# EAGLE design VIC20_HypExp (EAGLE 9.6.2)
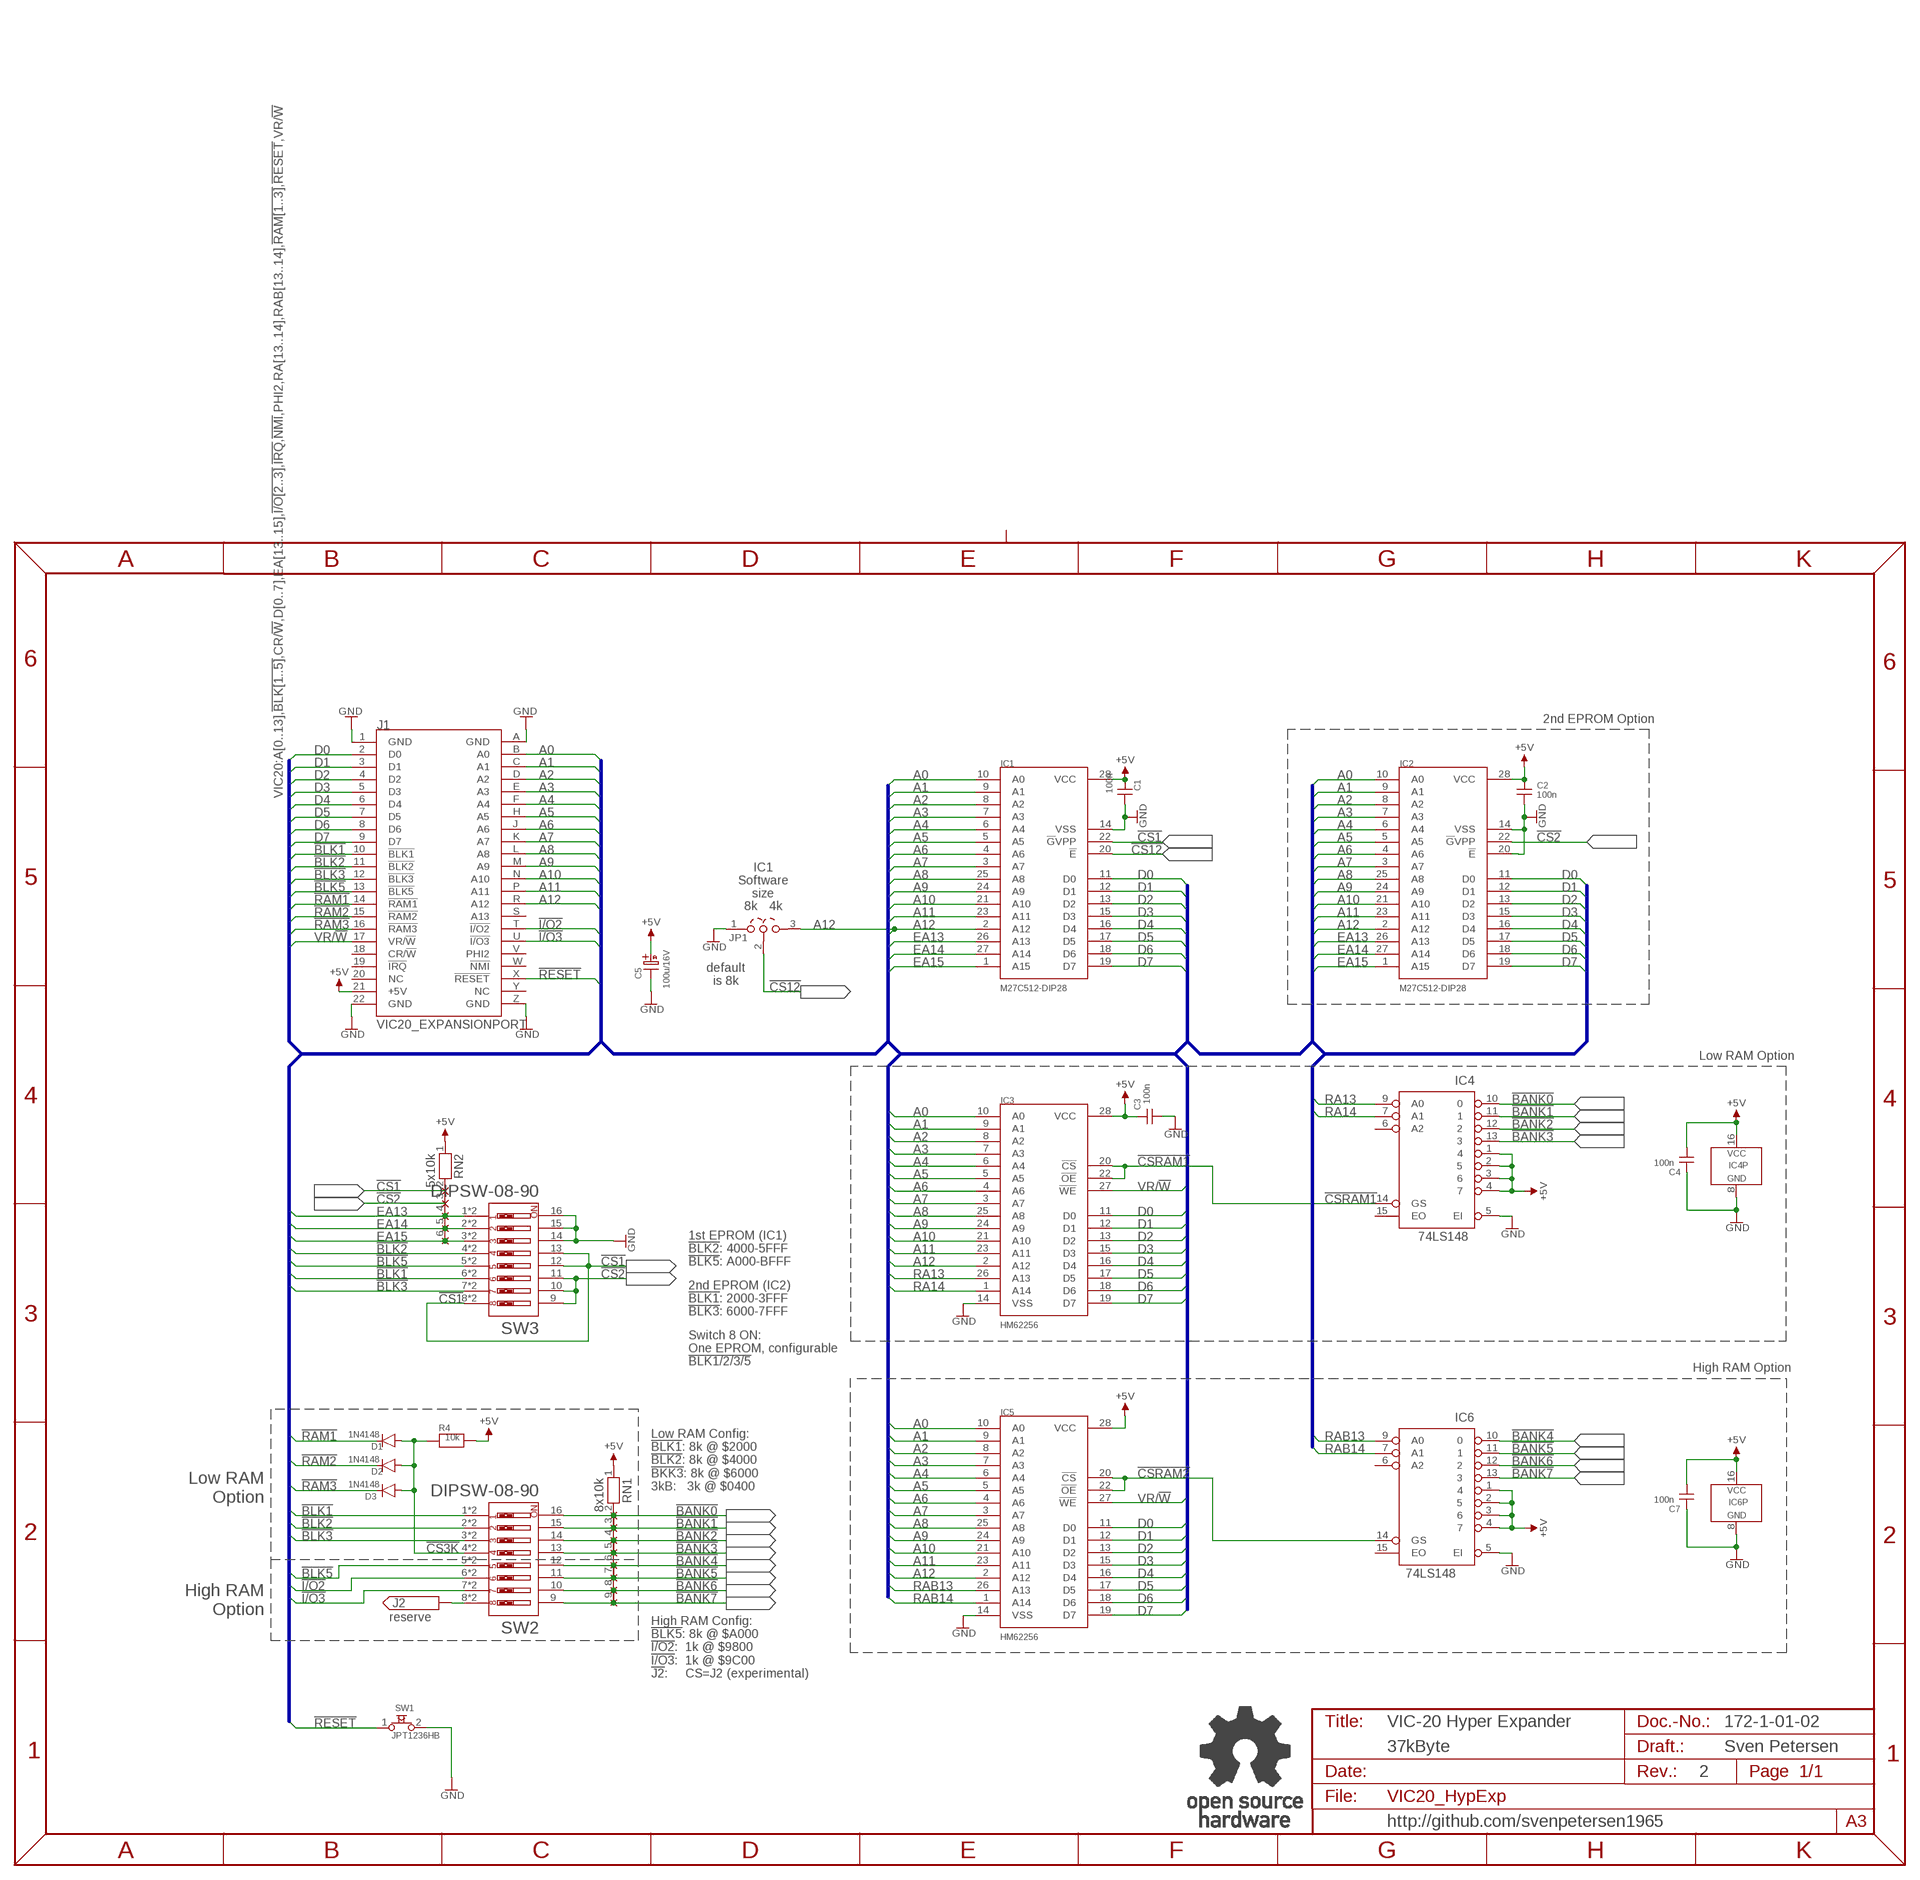
[diagram p0: schematic, sheet 1]

## Parts
C1  100n  CAP01  [C-2,5]
C2  100n  CAP01  [C-2,5]
C3  100n  CAP01  [C-2,5]
C4  100n  CAP01  [C-2,5]
C5  100u/16V  C07/2,5  [C07/2,5]
C7  100n  CAP01  [C-2,5]
D1  1N4148  1N41480.3"  [DO-35/3]
D2  1N4148  1N41480.3"  [DO-35/3]
D3  1N4148  1N41480.3"  [DO-35/3]
IC1  M27C512-DIP28  [DIL28-6]
IC2  M27C512-DIP28  [DIL28-6]
IC3  HM62256  [DIL28-6]
IC4  74LS148  74148DIL  [DIL-16]
IC5  HM62256  [DIL28-6]
IC6  74LS148  74148DIL  [DIL-16]
J1  VIC20_EXPANSIONPORT  [VIC20_EXPANSION]
J2  PINHD-1X1  [1X01]
JP1  COMBI-3P  [COMBI-3P]
R4  10k  RES04  [R-10]
RN1  8x10k  RN08  [RN-9]
RN2  5x10k  RN05  [RN-6]
SW1  JPT1236HB  [JTP_1236HB]
SW2  DIPSW-08-90  [DIPSW-08-90]
SW3  DIPSW-08-90  [DIPSW-08-90]
U$2  OPEN_SOURCE_HW  [OPENHW]

## Nets
!BANK0: IC4.10 RN1.2 SW2.16
!BANK1: IC4.11 RN1.3 SW2.15
!BANK2: IC4.12 RN1.4 SW2.14
!BANK3: IC4.13 RN1.5 SW2.13
!BANK4: IC6.10 RN1.6 SW2.12
!BANK5: IC6.11 RN1.7 SW2.11
!BANK6: IC6.12 RN1.8 SW2.10
!BANK7: IC6.13 RN1.9 SW2.9
!BLK1: J1.10(!BLK1) SW2.1 SW2.1A SW3.6 SW3.6A
!BLK2: J1.11(!BLK2) SW2.2 SW2.2A SW3.4 SW3.4A
!BLK3: J1.12(!BLK3) SW2.3 SW2.3A SW3.7 SW3.7A
!BLK5: J1.13(!BLK5) SW2.5 SW2.5A SW3.5 SW3.5A
!CS1: IC1.22(!G!VPP) RN2.2 SW3.8 SW3.8A SW3.12 SW3.13
!CS2: IC2.22(!G!VPP) RN2.3 SW3.9 SW3.10 SW3.11
!CS3K: D1.A D2.A D3.A R4.1 SW2.4 SW2.4A
!CS12: IC1.20(!E) JP1.2
!CSRAM1: IC3.20(!CS) IC3.22(!OE) IC4.14(GS)
!CSRAM2: IC5.20(!CS) IC5.22(!OE) IC6.14(GS)
!I/O2: J1.T(!I/O2) SW2.6 SW2.6A
!I/O3: J1.U(!I/O3) SW2.7 SW2.7A
!RAM1: D1.K J1.14(!RAM1)
!RAM2: D2.K J1.15(!RAM2)
!RAM3: D3.K J1.16(!RAM3)
!RESET: J1.X(!RESET) SW1.1
+5V: C1.1 C2.1 C3.2 C4.1 C5.A(+) C7.1 IC1.28(VCC) IC2.28(VCC) IC3.28(VCC) IC4.1 IC4.2 IC4.3 IC4.4 IC4.16(VCC) IC5.28(VCC) IC6.1 IC6.2 IC6.3 IC6.4 IC6.16(VCC) J1.21(+5V) R4.2 RN1.1 RN2.1
A0: IC1.10(A0) IC2.10(A0) IC3.10(A0) IC5.10(A0) J1.B(A0)
A1: IC1.9(A1) IC2.9(A1) IC3.9(A1) IC5.9(A1) J1.C(A1)
A2: IC1.8(A2) IC2.8(A2) IC3.8(A2) IC5.8(A2) J1.D(A2)
A3: IC1.7(A3) IC2.7(A3) IC3.7(A3) IC5.7(A3) J1.E(A3)
A4: IC1.6(A4) IC2.6(A4) IC3.6(A4) IC5.6(A4) J1.F(A4)
A5: IC1.5(A5) IC2.5(A5) IC3.5(A5) IC5.5(A5) J1.H(A5)
A6: IC1.4(A6) IC2.4(A6) IC3.4(A6) IC5.4(A6) J1.J(A6)
A7: IC1.3(A7) IC2.3(A7) IC3.3(A7) IC5.3(A7) J1.K(A7)
A8: IC1.25(A8) IC2.25(A8) IC3.25(A8) IC5.25(A8) J1.L(A8)
A9: IC1.24(A9) IC2.24(A9) IC3.24(A9) IC5.24(A9) J1.M(A9)
A10: IC1.21(A10) IC2.21(A10) IC3.21(A10) IC5.21(A10) J1.N(A10)
A11: IC1.23(A11) IC2.23(A11) IC3.23(A11) IC5.23(A11) J1.P(A11)
A12: IC1.2(A12) IC2.2(A12) IC3.2(A12) IC5.2(A12) J1.R(A12) JP1.3
D0: IC1.11(D0) IC2.11(D0) IC3.11(D0) IC5.11(D0) J1.2(D0)
D1: IC1.12(D1) IC2.12(D1) IC3.12(D1) IC5.12(D1) J1.3(D1)
D2: IC1.13(D2) IC2.13(D2) IC3.13(D2) IC5.13(D2) J1.4(D2)
D3: IC1.15(D3) IC2.15(D3) IC3.15(D3) IC5.15(D3) J1.5(D3)
D4: IC1.16(D4) IC2.16(D4) IC3.16(D4) IC5.16(D4) J1.6(D4)
D5: IC1.17(D5) IC2.17(D5) IC3.17(D5) IC5.17(D5) J1.7(D5)
D6: IC1.18(D6) IC2.18(D6) IC3.18(D6) IC5.18(D6) J1.8(D6)
D7: IC1.19(D7) IC2.19(D7) IC3.19(D7) IC5.19(D7) J1.9(D7)
EA13: IC1.26(A13) IC2.26(A13) RN2.4 SW3.1 SW3.1A
EA14: IC1.27(A14) IC2.27(A14) RN2.5 SW3.2 SW3.2A
EA15: IC1.1(A15) IC2.1(A15) RN2.6 SW3.3 SW3.3A
GND: C1.2 C2.2 C3.1 C4.2 C5.K(-) C7.2 IC1.14(VSS) IC2.14(VSS) IC2.20(!E) IC3.14(VSS) IC4.5(EI) IC4.8(GND) IC5.14(VSS) IC6.5(EI) IC6.8(GND) J1.1(GND) J1.22(GND) J1.A(GND) J1.Z(GND) JP1.1 SW1.2 SW3.14 SW3.15 SW3.16
N$1: J2.1 SW2.8 SW2.8A
RA13: IC3.26(A13) IC4.9(A0)
RA14: IC3.1(A14) IC4.7(A1)
RAB13: IC5.26(A13) IC6.9(A0)
RAB14: IC5.1(A14) IC6.7(A1)
VR/!W: IC3.27(!WE) IC5.27(!WE) J1.17(VR/!W)
Unconnected: IC4.6(A2) IC4.15(EO) IC6.6(A2) IC6.15(EO) J1.18(CR/!W) J1.19(!IRQ) J1.S(A13) J1.V(PHI2) J1.W(!NMI) J1.Y(NC)

## Buses
VIC20:A[0..13],!BLK[1..5],CR/!W,D[0..7],EA[13..15],!I/O[2..3],!IRQ,!NMI,PHI2,RA[13..14],RAB[13..14],!RAM[1..3],!RESET,VR/!W

## Notes on the sheet
- 2nd EPROM Option
- IC1
  Software
  size
- 8k | 4k
- default
  is 8k
- Low RAM Option
- 1st EPROM (IC1)
  !BLK2!: 4000-5FFF
  !BLK5!: A000-BFFF
- 2nd EPROM (IC2)
  !BLK1!: 2000-3FFF
  !BLK3!: 6000-7FFF
- Switch 8 ON:
  One EPROM, configurable
  !BLK1/2/3/5
- High RAM Option
- Low RAM Config:
  !BLK1!: 8k @ $2000
  !BLK2!: 8k @ $4000
  !BKK3!: 8k @ $6000
  3kB:   3k @ $0400
- Low RAM
  Option
- High RAM
  Option
- reserve
- High RAM Config:
  !BLK5!: 8k @ $A000
  !I/O2!:  1k @ $9800
  !I/O3!:  1k @ $9C00
  !J2!:     CS=J2 (experimental)
- VIC-20 Hyper Expander | 172-1-01-02
- 37kByte | Sven Petersen
- 2
- http://github.com/svenpetersen1965

## Power pins joined to a net without a drawn wire
NC: J1.20(NC)

## Library data of the parts
C1-C4 C7 = DISCRETE:CAP01
C5 = ELCO:C07/2,5
D1-D3 = Dioden:1N4148
IC1 IC2 = ST:M27C512
IC3 IC5 = Hitachi:HM62256
IC4 IC6 = 74XX:74148
J1 = Commodore:VIC20_EXPANSIONPORT
J2 = PINHEAD:PINHD-1X1
JP1 = Cutpad:COMBI-3P
R4 = DISCRETE:RES04
RN1 = DISCRETE:RN08
RN2 = DISCRETE:RN05
SW1 = Namae_Electronics:JPT1236HB
SW2 SW3 = DIPSWITCH:DIPSW-08
U$2 = Logo:OPEN_SOURCE_HW

## Board
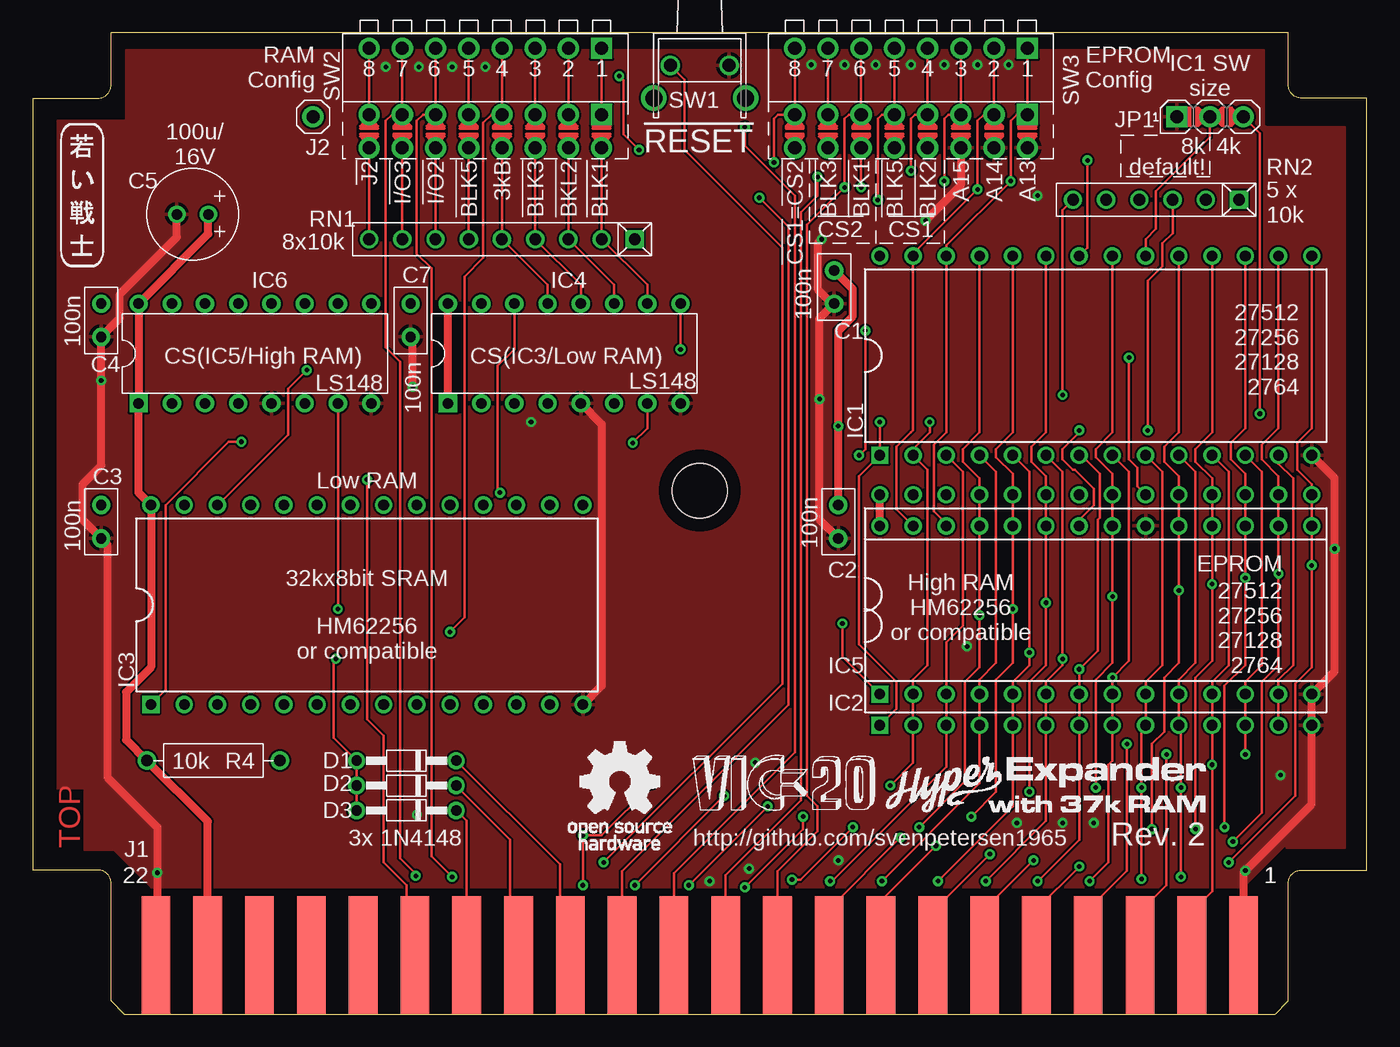
[diagram p1: board, top side]
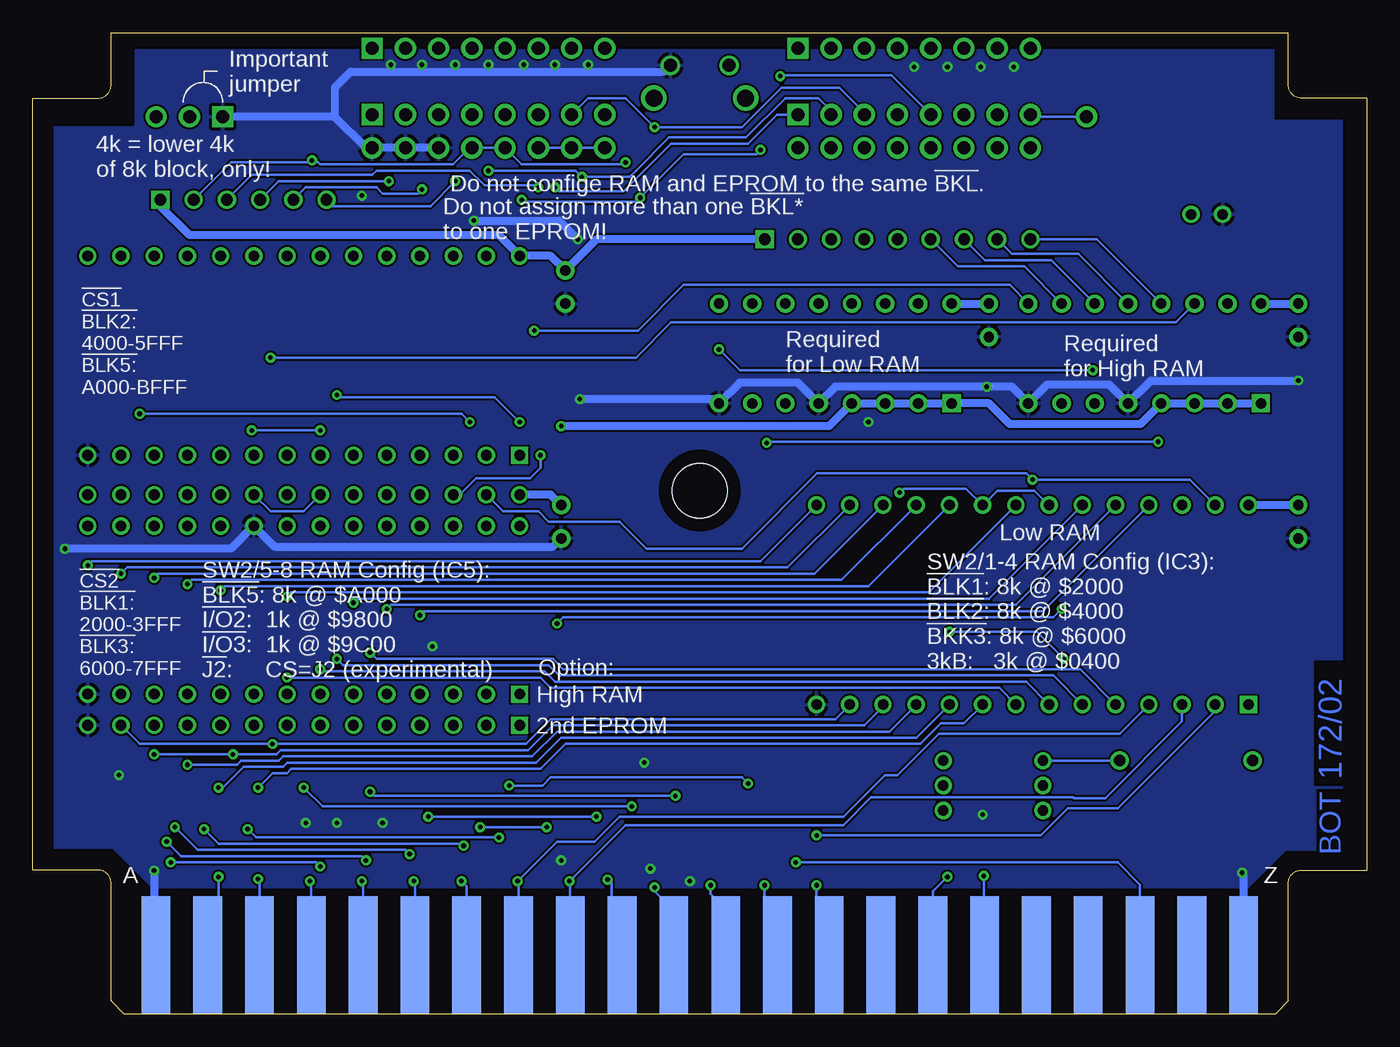
[diagram p2: board, bottom side, seen from below]

Size 102 x 75 mm. Coordinates in mm from the lower left corner, seen from the top.
Outline: 102,11 102,70 97,70 arc-90 96,71 96,75 6,75 6,71 arc-90 5,70 0,70 0,11
Copper layers (1*16): Top 0.035mm / dielectric 1.5mm / Bottom 0.035mm
Design rules "default *": minimum track width 6mil, minimum drill 0.35mm, track to track 6mil, track to pad 6mil, pad to pad 6mil, via to via 6mil, smd to smd 6mil, copper to edge 40mil, drill to drill 6mil, minimum pad ring 10mil, minimum via ring 8mil, stop-mask expansion 4mil, vias tented up to drill 23mil, thermal gap 10mil
Holes 4.2 mm at 51,40
bRestrict: 3 lines

### Footprints (pad centres in the part's own frame; a part is rotated, then mirrored left to right if it is on the bottom)
C-2,5 = drill 0.8 pad 1.397: 1 -1.27,0; 2 1.27,0
C07/2,5 = drill 0.813 pad 1.27: A -1.202,0; K 1.202,0
DO-35/3 = drill 0.8: A -3.81,0; K 3.81,0
DIL28-6 = drill 0.813 square: 1 -16.51,-7.62 | drill 0.813: 2 -13.97,-7.62; 3 -11.43,-7.62; 4 -8.89,-7.62; 5 -6.35,-7.62; 6 -3.81,-7.62; 7 -1.27,-7.62; 8 1.27,-7.62; 9 3.81,-7.62; 10 6.35,-7.62; 11 8.89,-7.62; 12 11.43,-7.62; 13 13.97,-7.62; 14 16.51,-7.62; 15 16.51,7.62; 16 13.97,7.62; 17 11.43,7.62; 18 8.89,7.62; 19 6.35,7.62; 20 3.81,7.62; 21 1.27,7.62; 22 -1.27,7.62; 23 -3.81,7.62; 24 -6.35,7.62; 25 -8.89,7.62; 26 -11.43,7.62; 27 -13.97,7.62; 28 -16.51,7.62
DIL-16 = drill 0.8 pad 1.397 square: 1 -8.89,-3.81 | drill 0.8 pad 1.397: 2 -6.35,-3.81; 3 -3.81,-3.81; 4 -1.27,-3.81; 5 1.27,-3.81; 6 3.81,-3.81; 7 6.35,-3.81; 8 8.89,-3.81; 9 8.89,3.81; 10 6.35,3.81; 11 3.81,3.81; 12 1.27,3.81; 13 -1.27,3.81; 14 -3.81,3.81; 15 -6.35,3.81; 16 -8.89,3.81
VIC20_EXPANSION = smd 2.2 x 9: 1 41.58,4.5; 2 37.62,4.5; 3 33.66,4.5; 4 29.7,4.5; 5 25.74,4.5; 6 21.78,4.5; 7 17.82,4.5; 8 13.86,4.5; 9 9.9,4.5; 10 5.94,4.5; 11 1.98,4.5; 12 -1.98,4.5; 13 -5.94,4.5; 14 -9.9,4.5; 15 -13.86,4.5; 16 -17.82,4.5; 17 -21.78,4.5; 18 -25.74,4.5; 19 -29.7,4.5; 20 -33.66,4.5; 21 -37.62,4.5; 22 -41.58,4.5 | smd 2.2 x 9 bottom: A 41.58,4.5; B 37.62,4.5; C 33.66,4.5; D 29.7,4.5; E 25.74,4.5; F 21.78,4.5; H 17.82,4.5; J 13.86,4.5; K 9.9,4.5; L 5.94,4.5; M 1.98,4.5; N -1.98,4.5; P -5.94,4.5; R -9.9,4.5; S -13.86,4.5; T -17.82,4.5; U -21.78,4.5; V -25.74,4.5; W -29.7,4.5; X -33.66,4.5; Y -37.62,4.5; Z -41.58,4.5
1X01 = drill 1 pad 1.626: 1 0,0
COMBI-3P = drill 1 pad 1.626 square: 1 -2.54,0 | drill 1 pad 1.626: 2 0,0; 3 2.54,0
R-10 = drill 0.889 pad 1.397: 1 -5.08,0; 2 5.08,0
RN-9 = drill 0.889 pad 1.397 square: 1 -10.16,0 | drill 0.889 pad 1.397: 2 -7.62,0; 3 -5.08,0; 4 -2.54,0; 5 0,0; 6 2.54,0; 7 5.08,0; 8 7.62,0; 9 10.16,0
RN-6 = drill 0.889 pad 1.397 square: 1 -6.35,0 | drill 0.889 pad 1.397: 2 -3.81,0; 3 -1.27,0; 4 1.27,0; 5 3.81,0; 6 6.35,0
JTP_1236HB = drill 1: 1 2.25,0; 2 -2.25,0 | drill 1.3: CS1 3.5,2.5; CS2 -3.5,2.5
DIPSW-08-90 = drill 1 pad 1.626 square: 1 -8.89,-1.27; 1A -8.89,-6.35 | drill 1 pad 1.626: 2 -6.35,-1.27; 2A -6.35,-6.35; 3 -3.81,-1.27; 3A -3.81,-6.35; 4 -1.27,-1.27; 4A -1.27,-6.35; 5 1.27,-1.27; 5A 1.27,-6.35; 6 3.81,-1.27; 6A 3.81,-6.35; 7 6.35,-1.27; 7A 6.35,-6.35; 8 8.89,-1.27; 8A 8.89,-6.35; 9 8.89,1.27; 10 6.35,1.27; 11 3.81,1.27; 12 1.27,1.27; 13 -1.27,1.27; 14 -3.81,1.27; 15 -6.35,1.27; 16 -8.89,1.27

### Placement (x,y rotation side)
C1  61.28,55.56 270 top
C2  61.59,37.62 270 top
C3  5.24,37.62 90 top
C4  5.24,53.02 270 top
C5  12.22,61.12 180 top
C7  28.89,53.02 270 top
D1  28.57,19.37 0 top
D2  28.57,17.46 0 top
D3  28.57,15.56 0 top
IC1  81.28,50.32 0 top
IC2  81.28,29.69 0 top
IC3  25.56,31.27 0 top
IC4  40.64,50.48 0 top
IC5  81.28,32.07 0 top
IC6  16.99,50.48 0 top
J1  51,0 0 top
J2  21.43,68.58 0 top
JP1  90.01,68.58 0 top
R4  13.81,19.37 180 top
RN1  35.88,59.21 180 top
RN2  85.88,62.23 180 top
SW1  51,72.5 180 top
SW2  34.61,67.47 180 top
SW3  67.15,67.47 180 top
U$2  40.96,12.54 0 top
U$15  [SVEN_TAG]  3.81,62.71 0 top
U$16  [2LAYER]  3.65,12.7 90 top
U$40  [PCB-TITLE/]  0,87 0 top  (outside the outline)
U$42  [VIC-20]  50.48,15.56 0 top
U$58  [HYPER_EXPANDER]  65.25,15.4 0 top

### Tracks (layer width: path | path; a pad name or v marks a point on that pad's centre or on a via)
!BANK0
  Top 0.203: SW2.16 RN1.2 46.99,55.72 IC4.10
!BANK1
  Top 0.203: SW2.15 RN1.3 44.45,55.72 IC4.11
!BANK2
  Top 0.203: SW2.14 RN1.4 41.91,55.72 IC4.12
!BANK3
  Top 0.203: SW2.13 RN1.5 39.37,55.72 IC4.13
!BANK4
  Top 0.203: SW2.12 RN1.6
  Bottom 0.203: IC6.10 26.19,57.15 31.27,57.15 RN1.6
!BANK5
  Top 0.203: SW2.11 RN1.7
  Bottom 0.203: IC6.11 24.13,57.63 29.21,57.63 RN1.7
!BANK6
  Top 0.203: SW2.10 RN1.8
  Bottom 0.203: IC6.12 22.07,58.1 27.15,58.1 RN1.8
!BANK7
  Top 0.203: SW2.9 RN1.9
  Bottom 0.203: IC6.13 20.64,59.21 RN1.9
!BLK1  (via drill 0.35)
  Top 0.203: 62.07,63.5 62.07,68.42 62.39,68.74 SW3.6 SW3.6A | 62.07,63.5 v62.07,63.19 | J1.10 56.94,10.9 59.21,13.18 60.01,13.97 60.01,15.88 59.21,16.67 59.21,16.83 59.21,60.33 v62.07,63.18 62.07,63.5 | SW2.1 43.5,72.65 SW2.1A
  Bottom 0.203: SW2.1 45.09,68.74 47.31,66.52 53.18,66.52 56.83,62.87 61.75,62.87 v62.07,63.19
!BLK2  (via drill 0.35)
  Top 0.203: v67.15,64.45 67.15,68.42 67.47,68.74 SW3.4 SW3.4A | J1.11 52.98,10.59 58.74,16.35 58.74,61.28 60.01,62.55 v60.01,63.98 | SW2.2 SW2.2A
  Bottom 0.203: SW2.2 40.96,69.06 41.91,70.01 44.45,70.01 47.47,66.99 53.34,66.99 55.88,64.45 56.36,63.98 v60.01,63.98 60.48,64.45 v67.15,64.45
!BLK3  (via drill 0.35)
  Top 0.203: J1.12 49.02,10.76 58.26,20 58.26,62.55 54.45,66.36 v54.45,67.79 | SW2.3 SW2.3A | SW3.7 SW3.7A
  Bottom 0.203: SW3.7 59.53,70.01 56.67,70.01 v54.45,67.79 47.78,67.79 44.77,70.8 40.32,70.8 38.42,68.9 SW2.3
!BLK5  (via drill 0.35)
  Top 0.203: v64.61,62.23 64.61,68.42 64.93,68.74 SW3.5 SW3.5A | v44.85,71.68 45.16,71.36 45.16,67.23 v46.35,66.04 | J1.13 45.06,10.93 57.78,23.65 57.78,60.17 v55.56,62.39 | SW2.5 SW2.5A
  Bottom 0.203: SW2.5 36.35,71.75 44.77,71.75 v44.85,71.68 | v46.35,66.04 46.67,65.72 52.23,65.72 v55.56,62.39 55.88,62.07 64.45,62.07 v64.61,62.23
!CS1  (via drill 0.35)
  Top 0.203: v56.67,65.09 56.67,68.42 56.99,68.74 SW3.8 SW3.8A | IC1.22 80.64,58.58 v80.64,65.25
  Bottom 0.203: v56.67,65.09 56.83,64.93 64.61,64.93 SW3.12 SW3.13 68.58,66.2 69.85,64.93 80.01,64.93 80.17,65.09 80.49,65.09 v80.64,65.25 80.8,65.09 86.84,65.09 RN2.2
!CS2  (via drill 0.35)
  Top 0.203: IC2.22 80.01,37.78 81.12,38.89 81.12,40.16 79.69,41.59 79.53,41.59 78.74,42.39 78.74,43.18 80.01,44.45 v80.01,44.61 | v85.25,44.61 85.25,56.04 86.36,57.15 86.36,58.9 87.15,59.69 RN2.3 | SW3.11 v63.34,63.18
  Bottom 0.203: v80.01,44.61 v85.25,44.61 | SW3.9 SW3.10 SW3.11 | v63.34,63.18 63.5,63.34 66.83,63.34 67.47,63.34 68.58,64.45 75.72,64.45 76.04,64.14 85.25,64.14 RN2.3
!CS3K  (via drill 0.35)
  Top 0.203: D3.A D2.A D1.A 23.02,21.11 23.02,27.15 v23.18,27.15 | v31.91,29.21 33.02,30.32 33.02,56.36 34.45,57.78 34.45,68.1 35.08,68.74 SW2.4 SW2.4A
  Bottom 0.203: D1.A R4.1 | v31.91,29.21 25.24,29.21 v23.18,27.15
!CS12
  Top 0.203: IC1.20 85.09,59.21 85.88,60.01 85.88,62.87 90.01,66.99 JP1.2
!CSRAM1  (via drill 0.35)
  Top 0.203: IC4.14 36.83,50.8 35.56,49.53 35.56,40.01 v35.72,39.85
  Bottom 0.203: IC3.22 25.4,40.01 28.26,40.01 IC3.20 30.64,40.16 35.4,40.16 v35.72,39.85
!CSRAM2  (via drill 0.35)
  Top 0.203: IC5.20 84.45,40.32 84.45,41.75 83.82,42.39 v83.82,50.16
  Bottom 0.203: IC5.20 83.82,38.42 81.28,38.42 IC5.22 | IC6.14 14.61,52.86 53.18,52.86 55.88,50.16 v83.82,50.16
!I/O2  (via drill 0.35)
  Top 0.203: v32.07,10.48 30.48,12.06 30.48,56.99 29.37,58.1 29.37,68.26 29.84,68.74 SW2.6 SW2.6A
  Bottom 0.203: v32.07,10.48 33.18,9.37 J1.T
!I/O3  (via drill 0.35)
  Top 0.203: v29.29,10.56 29.37,10.64 28.1,11.91 28.1,49.85 26.99,50.96 26.99,68.26 27.46,68.74 SW2.7 SW2.7A
  Bottom 0.203: v29.29,10.56 29.29,4.57 J1.U
!RAM1
  Top 0.203: J1.14 40.31,5.29 40.31,9.51 40.32,9.53 40.32,11.43 D1.K
!RAM2
  Top 0.203: J1.15 36.51,5.13 36.51,13.34 D2.K
!RAM3
  Top 0.203: D3.K 33.18,14.76 J1.16
!RESET  (via drill 0.35)
  Top 0.203: v43.66,11.59 57.31,25.24 57.31,58.58 49.85,66.04 49.85,71.4 SW1.1
  Bottom 0.203: J1.X 17.34,9.88 19.05,11.59 v43.66,11.59
+5V  (via drill 0.35)
  Top 0.61: IC4.1 IC4.16 | IC2.28 IC5.28 | C2.1 v61.59,44.93 61.59,52.23 62.71,53.34 62.71,55.4 C1.1 | C5.A 13.43,59.62 IC6.16 IC6.1 8.1,39.85 IC3.28 9.05,26.51 7.14,24.61 7.14,20.95 R4.2 13.38,14.72 J1.21
  Bottom 0.61: IC4.16 C7.1 | RN1.1 58.9,59.21 C1.1 62.39,57.94 IC1.28 66.36,59.53 90.01,59.53 92.23,61.75 RN2.1 | IC6.1 IC6.2 IC6.3 IC6.4 17.3,45.09 27.3,45.09 28.89,46.67 IC4.1 IC4.2 IC4.3 IC4.4 41.12,44.93 v61.59,44.93 | IC6.16 C4.1 | C2.1 62.39,39.69 IC5.28 | C3.2 IC3.28
A0  (via drill 0.35)
  Top 0.203: v87.79,10.48 v87.79,17.3 87.79,21.91 IC2.10 IC5.10 87.63,25.56 88.9,26.83 88.9,41.43 IC1.10
  Bottom 0.203: J1.B 87.79,5.33 v87.79,10.48 | v87.79,17.3 87.47,17.3 85.88,18.89 82.87,18.89 82.55,19.21 63.5,19.21 61.59,21.11 34.45,21.11 IC3.10
A1  (via drill 0.35)
  Top 0.203: v84.77,10.32 v84.77,17.3 84.77,21.75 IC2.9 IC5.9 85.09,25.4 86.36,26.67 86.36,41.43 IC1.9
  Bottom 0.203: J1.C 84.66,10.21 v84.77,10.32 | v84.77,17.3 83.66,18.41 82.55,18.41 82.23,18.73 63.18,18.73 61.28,20.64 34.13,20.64 32.54,22.23 30.8,22.23 IC3.9
A2  (via drill 0.35)
  Top 0.203: v80.8,10.16 82.23,11.59 82.23,19.05 82.55,19.37 IC2.8 IC5.8 v82.55,25.72 83.82,26.99 83.82,41.43 IC1.8
  Bottom 0.203: J1.D 80.7,10.06 v80.8,10.16 | IC3.8 28.1,24.92 62.39,24.92 63.18,25.72 v82.55,25.72
A3  (via drill 0.35)
  Top 0.203: v76.83,10.16 80.01,13.34 IC2.7 IC5.7 80.01,25.88 v80.01,26.35 81.44,27.78 81.44,37.78 81.6,37.94 81.6,41.27 80.17,42.7 IC1.7
  Bottom 0.203: J1.E 76.74,10.06 v76.83,10.16 | IC3.7 26.04,25.4 62.07,25.4 62.87,26.19 79.85,26.19 v80.01,26.35
A4  (via drill 0.35)
  Top 0.203: v72.87,10.16 77.47,14.76 IC2.6 IC5.6 77.47,25.4 78.74,26.67 v78.74,27.15 78.74,41.43 IC1.6
  Bottom 0.203: J1.F 72.78,10.07 v72.87,10.16 | IC3.6 23.97,25.88 61.75,25.88 62.55,26.67 78.26,26.67 v78.74,27.15
A5  (via drill 0.35)
  Top 0.203: v69.22,10.16 74.93,15.88 IC2.5 IC5.5 74.93,25.4 76.2,26.67 v76.2,27.62 76.2,41.43 IC1.5
  Bottom 0.203: J1.H 68.82,9.77 v69.22,10.16 | IC3.5 21.91,26.35 61.44,26.35 62.23,27.15 75.72,27.15 v76.2,27.62
A6  (via drill 0.35)
  Top 0.203: v64.93,10.16 72.39,17.62 IC2.4 IC5.4 72.39,25.56 73.66,26.83 73.66,41.43 IC1.4
  Bottom 0.203: J1.J 64.86,10.09 v64.93,10.16 61.91,13.18 59.05,13.18 57.15,15.08 40.01,15.08 36.83,18.26 35.88,18.26 32.7,21.43 18.89,21.43 IC3.4
A7  (via drill 0.35)
  Top 0.203: IC1.3 71.12,41.43 71.12,29.69 69.85,28.42 IC5.3 IC2.3 69.85,18.89 61.04,10.08 v60.96,10.16
  Bottom 0.203: J1.K 60.9,10.1 v60.96,10.16 56.67,14.45 40.01,14.45 37.9,16.55 22.43,16.55 22.38,16.51 20,16.51 14.13,22.38 IC3.3
A8  (via drill 0.35)
  Top 0.203: v67.79,14.29 71.28,17.78 71.28,25.4 72.39,26.51 v72.39,30.48 IC2.25 IC5.25 72.39,40.96 71.12,42.23 71.12,43.18 72.39,44.45 IC1.25 | v62.71,14.29 58.69,10.27 v58.05,10.27
  Bottom 0.203: v58.05,10.27 57.73,10.27 57.73,5.29 J1.L | v67.79,14.29 v62.71,14.29 | IC3.25 24.77,30.8 72.07,30.8 v72.39,30.48
A9  (via drill 0.35)
  Top 0.203: IC1.24 74.93,44.45 73.66,43.18 73.66,42.55 74.93,41.27 IC5.24 IC2.24 v74.93,30.96 74.93,26.83 73.66,25.56 73.66,16.99 v71.75,15.08 | v54.45,9.68 58.9,14.13 v58.9,15.08
  Bottom 0.203: J1.M 53.46,4.98 53.46,8.37 54.45,9.37 v54.45,9.68 | v71.75,15.08 v58.9,15.08 | IC3.24 26.83,31.27 74.61,31.27 v74.93,30.96
A10  (via drill 0.35)
  Top 0.203: IC1.21 82.55,44.45 81.28,43.18 81.28,42.55 82.55,41.27 IC5.21 IC2.21 v82.55,31.91 82.55,26.83 81.28,25.56 v81.28,17.3 | v50.16,9.84 v56.2,15.88
  Bottom 0.203: J1.N 49.02,8.06 50.16,9.21 v50.16,9.84 | v56.2,15.88 79.85,15.88 v81.28,17.3 | IC3.21 33.5,32.23 82.23,32.23 v82.55,31.91
A11  (via drill 0.35)
  Top 0.203: IC1.23 77.47,44.45 76.36,43.34 76.36,42.23 77.47,41.12 IC5.23 IC2.23 v77.47,31.43 77.47,26.67 76.2,25.4 v76.2,16.99 | v46.04,9.84 v52.86,16.67
  Bottom 0.203: J1.P 46.04,5.48 v46.04,9.84 | v52.86,16.67 75.88,16.67 v76.2,16.99 | IC3.23 28.89,31.75 77.15,31.75 v77.47,31.43
A12  (via drill 0.35)
  Top 0.203: v68.58,45.24 68.58,44.45 67.31,43.18 IC1.2 68.42,41.59 68.42,26.67 67.31,25.56 IC5.2 IC2.2 67.31,19.21 v65.56,17.46 | v93.82,45.88 93.82,67.31 JP1.3 | v47.31,17.62 47.31,17.46 43.5,13.65 v42.07,13.65 v42.07,9.84
  Bottom 0.203: v68.58,45.24 69.22,45.88 v93.82,45.88 | J1.R 42.07,5.47 v42.07,9.84 | v65.56,17.46 63.02,17.46 62.39,18.1 47.78,18.1 v47.31,17.62 | v42.07,13.65 24.92,13.65 22.86,15.72 19.05,15.72 11.59,23.18 IC3.2
D0  (via drill 0.35)
  Top 0.203: J1.2 88.62,7.82 90.17,9.37 v90.17,19.05 IC2.11 IC5.11 90.17,25.4 91.44,26.67 91.44,41.43 IC1.11
  Bottom 0.203: v90.17,19.05 86.36,19.05 86.04,19.37 83.19,19.37 82.87,19.68 63.82,19.68 61.91,21.59 36.51,21.59 IC3.11
D1  (via drill 0.35)
  Top 0.203: J1.3 84.66,7.83 86.68,9.84 v86.68,19.84 | v92.71,19.84 IC2.12 IC5.12 92.71,25.4 93.98,26.67 93.98,41.43 IC1.12
  Bottom 0.203: v92.71,19.84 v86.68,19.84 83.34,19.84 83.03,20.16 69.22,20.16 64.14,20.16 62.23,22.07 38.42,22.07 36.99,23.5 IC3.12
D2  (via drill 0.35)
  Top 0.203: J1.4 80.7,7.99 83.66,10.95 v83.66,20.64 | IC2.13 IC5.13 95.25,25.56 96.36,26.67 96.36,40.96 95.25,42.07 IC1.13
  Bottom 0.203: IC3.13 40.64,22.54 62.39,22.54 64.29,20.64 v83.66,20.64 93.82,20.64 IC2.13
D3  (via drill 0.35)
  Top 0.203: J1.5 76.74,8 v80.01,11.27 | v91.44,11.59 96.52,16.67 96.52,25.24 97.79,26.51 v97.79,34.29 IC2.15 IC5.15 97.79,40.48 96.68,41.59 96.68,43.66 97.79,44.77 IC1.15
  Bottom 0.203: v80.01,11.27 80.33,11.59 v91.44,11.59 | IC3.15 46.35,34.61 97.47,34.61 v97.79,34.29
D4  (via drill 0.35)
  Top 0.203: J1.6 72.78,8.01 v76.52,11.75 | v91.76,13.18 93.98,15.4 93.98,25.4 95.25,26.67 v95.25,33.66 IC2.16 IC5.16 95.25,41.12 93.98,42.39 93.98,43.5 95.25,44.77 IC1.16
  Bottom 0.203: v76.52,11.75 76.83,12.06 90.65,12.06 v91.76,13.18 | IC3.16 44.29,34.13 94.77,34.13 v95.25,33.66
D5  (via drill 0.35)
  Top 0.203: J1.7 68.82,7.86 v73.18,12.22 | v91.12,14.29 91.12,25.08 92.71,26.67 v92.71,33.34 IC2.17 IC5.17 92.71,41.27 91.6,42.39 91.6,43.66 92.71,44.77 IC1.17
  Bottom 0.203: v73.18,12.22 73.5,12.54 89.38,12.54 v91.12,14.29 | IC3.17 42.23,33.66 92.39,33.66 v92.71,33.34
D6  (via drill 0.35)
  Top 0.203: J1.8 64.86,8.66 v69.06,12.86 | v88.9,14.13 88.9,25.72 90.17,26.99 v90.17,32.86 IC2.18 IC5.18 90.17,40.96 88.9,42.23 88.9,43.18 90.17,44.45 IC1.18
  Bottom 0.203: v69.06,12.86 69.22,13.02 87.79,13.02 v88.9,14.13 | IC3.18 40.16,33.18 89.85,33.18 v90.17,32.86
D7  (via drill 0.35)
  Top 0.203: J1.9 60.9,8.04 v66.36,13.49 | v85.57,14.13 85.57,20.64 86.52,21.59 86.52,25.72 87.63,26.83 v87.63,32.38 IC2.19 IC5.19 87.63,41.12 86.52,42.23 86.52,43.34 87.63,44.45 IC1.19
  Bottom 0.203: v85.57,14.13 84.93,13.49 v66.36,13.49 | IC3.19 38.1,32.7 87.31,32.7 v87.63,32.38
EA13  (via drill 0.35)
  Top 0.203: IC2.26 69.85,37.47 68.9,38.42 68.9,43.5 69.85,44.45 IC1.26 69.85,58.74 v74.77,63.66 74.77,68.26 75.25,68.74 SW3.1 SW3.1A
  Bottom 0.203: RN2.4 83.19,63.66 v74.77,63.66
EA14  (via drill 0.35)
  Top 0.203: IC2.27 66.04,38.58 66.04,43.34 67.15,44.45 67.31,44.61 IC1.27 67.31,58.1 v72.23,63.02 72.23,68.26 72.71,68.74 SW3.2 SW3.2A
  Bottom 0.203: RN2.5 81.12,63.18 75.72,63.18 75.25,62.71 72.55,62.71 v72.23,63.02
EA15  (via drill 0.35)
  Top 0.203: IC2.1 66.04,23.34 66.04,25.4 63.18,28.26 63.18,41.12 IC1.1 v64.77,45.24 | v78.74,47.31 78.74,61.44 RN2.6 | v69.69,63.66 69.69,68.42 70.01,68.74 SW3.3 SW3.3A
  Bottom 0.203: v64.77,45.24 66.67,47.15 78.58,47.15 v78.74,47.31 | RN2.6 79.06,61.75 71.6,61.75 v69.69,63.66
GND  (via drill 0.35)
  Top 0.61: J1.A 92.58,10.82 v92.71,10.95 97.79,16.03 IC2.14 IC5.14 99.54,26.19 v99.54,35.56 99.54,40.96 IC1.14 | IC4.5 43.5,45.09 43.5,25.08 IC3.14 | C5.K 11.02,59.37 6.67,55.02 6.67,53.18 C4.2 v5.24,48.42 5.24,41.91 3.81,40.48 3.81,37.78 C3.1 5.71,35.88 5.71,18.1 9.53,14.29 v9.53,10.79 9.53,4.61 J1.Z | v29.05,47.94 29.05,51.59 C7.2 | SW3.14 70.96,63.34 v68.26,60.64 | C2.2 60.17,37.78 v60.17,46.99 60.17,53.18 C1.2 61.12,54.29 60.01,55.4 60.01,58.9 v60.33,59.21
  Bottom 0.61: v92.71,10.95 92.71,4.63 J1.A | v99.54,35.56 86.84,35.56 IC2.20 83.5,35.72 62.23,35.72 C2.2 | SW3.14 SW3.15 SW3.16 76.52,66.2 78.9,68.58 | 78.9,68.58 JP1.1 | SW1.2 53.73,72.02 77.68,72.02 78.9,70.8 78.9,68.58 | v5.24,48.42 16.51,48.42 IC6.5 19.68,48.1 24.45,48.1 IC6.8 27.15,47.94 v29.05,47.94 40.64,47.94 IC4.5 43.5,48.26 47.94,48.26 IC4.8 49.85,46.99 v60.17,46.99 | J1.Z 9.42,10.69 v9.53,10.79 | v68.26,60.64 61.75,60.64 v60.33,59.21
  other vias: 29.37,15.24 61.59,11.75 55.24,19.21 51.75,10.16 78.74,14.61 75.25,14.61 81.12,14.61 71.44,28.1 95.41,18.26 38.1,45.24 76.83,62.55 54.77,11.11 26.99,72.39 29.53,72.39 32.07,72.39 34.61,72.39 59.53,72.55 62.07,72.55 64.45,72.55 67.15,72.55 69.69,72.55 72.23,72.55 74.61,72.55
  pour Top: 1.91,68.26 7.14,68.26 7.14,73.66 94.14,73.66 94.14,67.94 94.3,67.79 100.33,67.79 100.33,12.7 95.89,12.7 95.73,12.86 92.55,9.68 9.05,9.68 6.19,12.54 1.91,12.54
  pour Bottom: 1.91,68.26 7.14,68.26 7.14,73.66 94.14,73.66 94.14,67.94 94.3,67.79 100.33,67.79 100.33,12.7 95.89,12.7 92.87,9.68 91.6,9.68 9.05,9.68 6.19,12.54 1.91,12.54
N$1
  Top 0.203: SW2.8 SW2.8A
  Bottom 0.203: SW2.8 25.56,68.58 J2.1
RA13  (via drill 0.35)
  Top 0.203: IC3.26 19.53,44.29 19.53,47.78 v20.95,49.21 | v49.53,50.8 IC4.9
  Bottom 0.203: v20.95,49.21 47.94,49.21 v49.53,50.8
RA14  (via drill 0.35)
  Top 0.203: IC3.1 10.16,24.77 10.16,38.89 15,43.74 v15.95,43.74 | v45.88,43.66 46.99,44.77 IC4.7
  Bottom 0.203: v15.95,43.74 45.8,43.74 v45.88,43.66
RAB13  (via drill 0.35)
  Top 0.203: v63.18,42.7 63.66,43.18 v63.66,52.23
  Bottom 0.203: IC6.9 27.3,55.72 52.23,55.72 55.72,52.23 v63.66,52.23 | IC5.26 69.37,39.69 68.1,40.96 63.98,40.96 63.18,41.75 v63.18,42.7
RAB14  (via drill 0.35)
  Top 0.203: IC5.1 61.91,27.3 v61.91,29.84 | v23.34,30.96 IC6.7
  Bottom 0.203: v61.91,29.84 61.44,30.32 23.97,30.32 v23.34,30.96
VR/!W  (via drill 0.35)
  Top 0.203: J1.17 28.57,5.14 28.57,9.84 26.83,11.59 26.83,21.27 25.56,22.54 v25.56,40.84
  Bottom 0.203: IC5.27 66.04,38.42 63.34,38.42 62.55,37.62 57.15,37.62 55.09,35.56 47.78,35.56 42.03,41.31 26.04,41.31 v25.56,40.84 13.53,40.84 IC3.27

### Text on the board
Bottom: 172/02
tPlace: RAM / Config | EPROM / Config | IC1 SW / size | !RESET | 8k | 4k | 100u/ / 16V | !J2 | !I/O3 | !I/O2 | !BLK5 | 3kB | !BLK3 | !BKL2 | !BLK1 | !CS1!=!CS2 | !BLK3 | !BLK1 | !BLK5 | !BLK2 | A15 | A14 | A13 | default! | !CS2 | !CS1 | 5 x / 10k | 8x10k | 100n | 100n | 27512 / 27256 / 27128 / 2764 | CS(IC5/High RAM) | CS(IC3/Low RAM) | LS148 | LS148 | 100n | Low RAM | 100n | 100n | EPROM | 32kx8bit SRAM | High RAM | 27512 / 27256 / 27128 / 2764 | HM62256 / or compatible | HM62256 / or compatible | 10k | 3x 1N4148 | http://github.com/svenpetersen1965 | Rev. 2
bPlace: Important / jumper | 4k = lower 4k / of 8k block, only! | Do not confige RAM and EPROM to the same !BKL!. | Do not assign more than one !BKL*! / to one EPROM! | !CS1 / !BLK2: / 4000-5FFF / !BLK5: / A000-BFFF | Required / for High RAM | Required / for Low RAM | Low RAM | SW2/1-4 RAM Config (IC3): / !BLK1!: 8k @ $2000 / !BLK2!: 8k @ $4000 / !BKK3!: 8k @ $6000 / 3kB: 3k @ $0400 | Option: | SW2/5-8 RAM Config (IC5): / !BLK5!: 8k @ $A000 / !I/O2!: 1k @ $9800 / !I/O3!: 1k @ $9C00 / !J2!: CS=J2 (experimental) | !CS2 / !BLK1: / 2000-3FFF / !BLK3: / 6000-7FFF | High RAM | 2nd EPROM
Document: 172-2-01-02 | Sven Petersen / 2021 | 35µm | 2 | 2